# EAGLE design 209_ktemp (EAGLE 9.6.2)
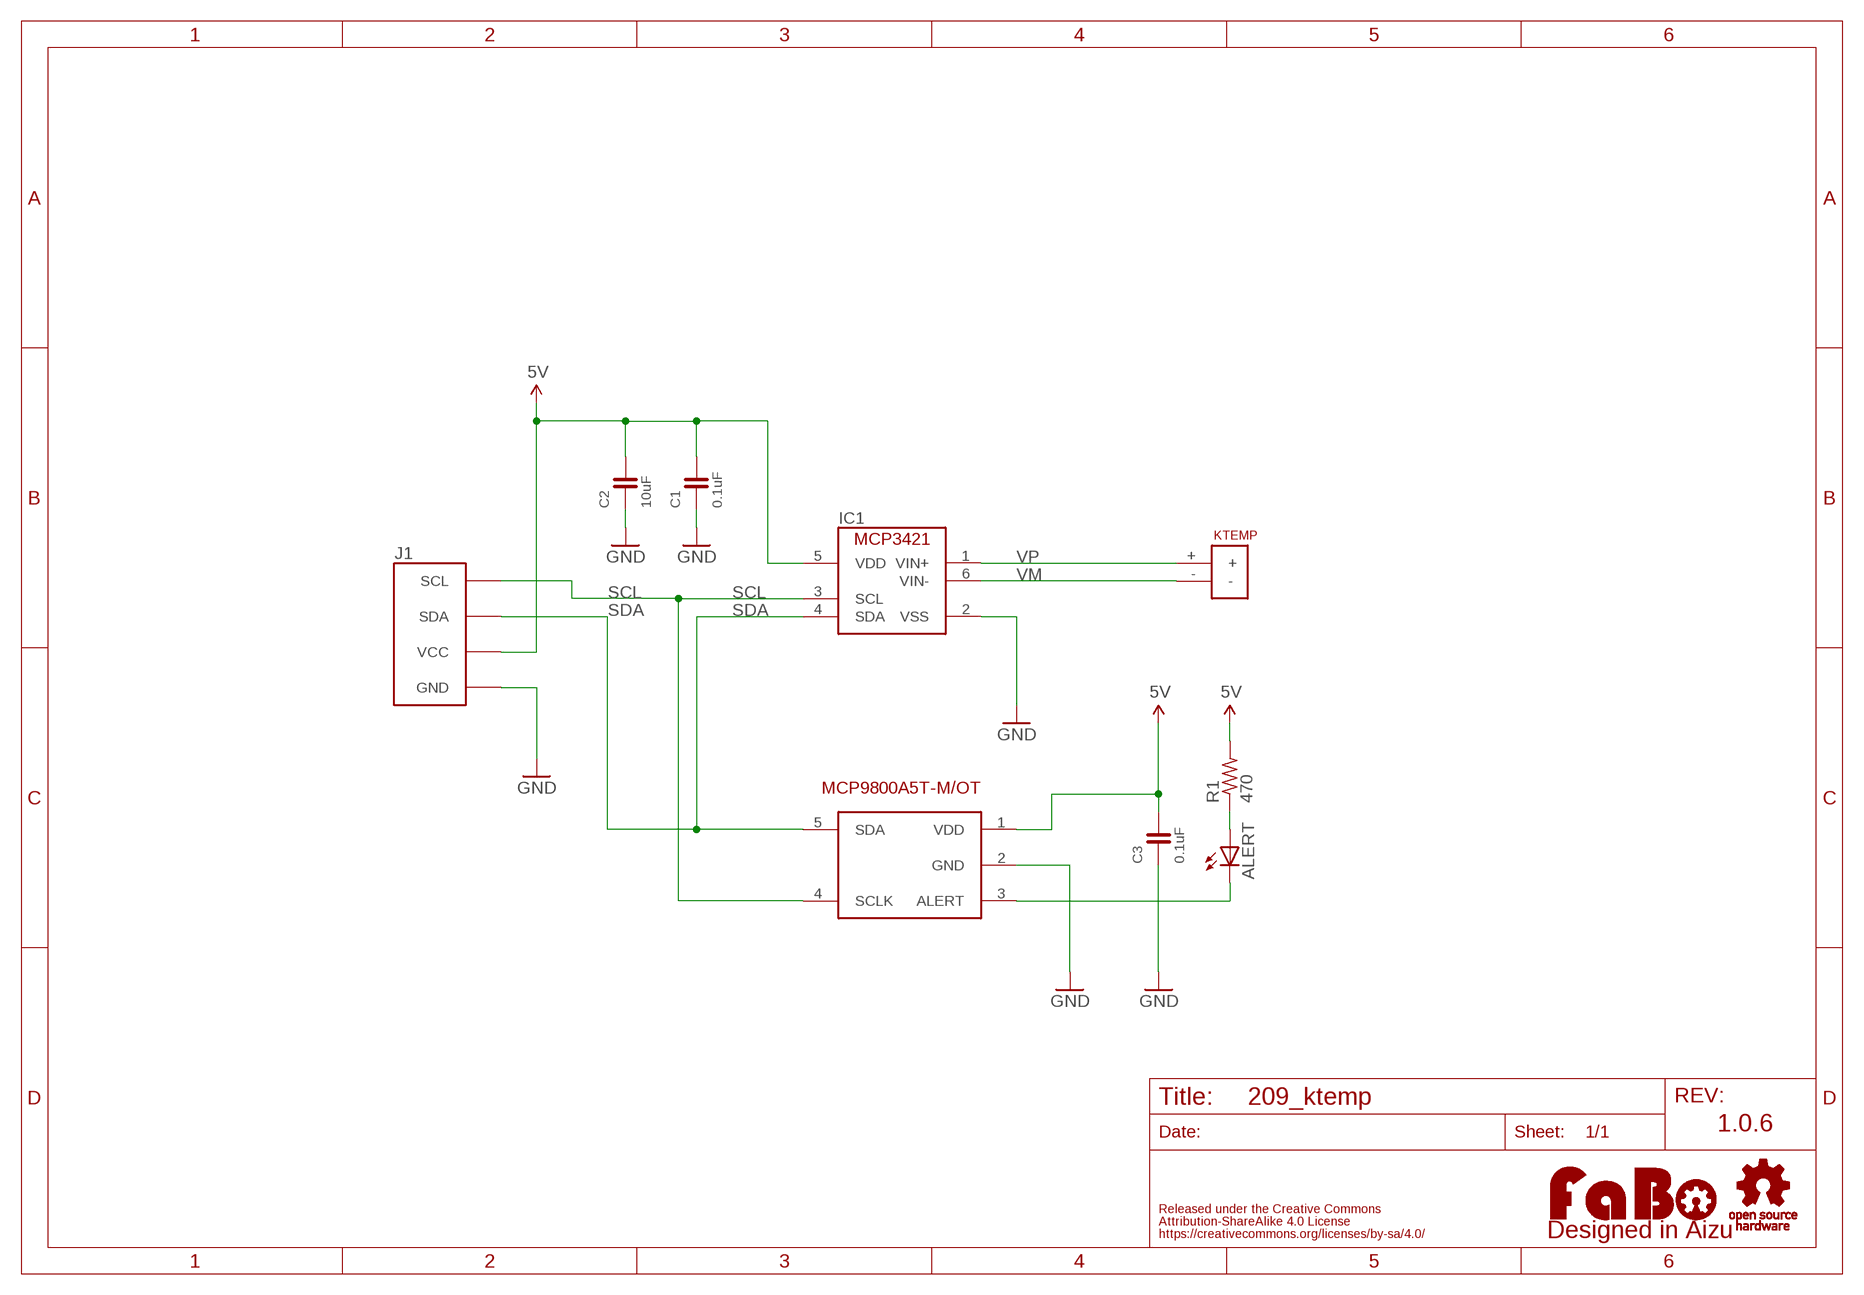
[diagram p0: schematic, sheet 1]

## Parts
ALERT  LEDCHIP-LED0603  [CHIP-LED0603]
C1  0.1uF  CAPACITOR-0603  [0603]
C2  10uF  CAPACITOR-0603  [0603]
C3  0.1uF  CAPACITOR-0603  [0603]
IC1  MCP3421  [SOT-23]
J1  FABO_BRICK_I2CI2C_TEMP_LOG2  [FABO_BRICK_I2C_LONG2]
LOGO1  LOGO_FABO-M  [LOGO_FABO_M]
R1  470  R-US_R0603  [R0603]
U$2  PCC-SMP-J  [PCC-SMP-J]
U$3  LOGO_OSHW-M_BOTTOM  [LOGO_OSHW_M_BOTTOM]
U$5  MCP9800_SOT-23  [SOT23-5]

## Nets
5V: C1.2 C2.2 C3.2 IC1.5(VDD) J1.VCC R1.2 U$5.1(VDD)
GND: C1.1 C2.1 C3.1 IC1.2(VSS) J1.GND U$5.2(GND)
N$1: ALERT.A R1.1
N$2: ALERT.C U$5.3(ALERT)
SCL: IC1.3(SCL) J1.SCL U$5.4(SCLK)
SDA: IC1.4(SDA) J1.SDA U$5.5(SDA)
VM: IC1.6(VIN-) U$2.-
VP: IC1.1(VIN+) U$2.+

## Notes on the sheet
- 1.0.6

## Library data of the parts
ALERT = led:LED: LED OSRAM: - CHIPLED LG R971, LG N971, LY N971, LG Q971, LY Q971, LO R971, LY R971 LH N974, LH R974 LS Q976, LO Q976, LY Q976 LO Q996 - Hyper CHIPLED LW Q18S LB Q993, LB Q99A, LB R99A - SideLED LS A670, LO A670, LY A670, LG A670, LP A670 LB A673, LV A673, LT A673, LW A673 LH A674 LY A675 LS A676, LA A676, LO A676, LY A676, LW A676 LS A679, LY A679, LG A679 - Hyper Micro SIDELED® LS Y876, LA Y876, LO Y876, LY Y876 LT Y87S - SmartLED LW L88C, LW L88S LB L89C, LB L89S, LG L890 LS L89K, LO L89K, LY L89K LS L896, LA L896, LO L896, LY L896 - TOPLED LS T670, LO T670, LY T670, LG T670, LP T670 LSG T670, LSP T670, LSY T670, LOP T670, LYG T670 LG T671, LOG T671, LSG T671 LB T673, LV T673, LT T673, LW T673 LH T674 LS T676, LA T676, LO T676, LY T676, LB T676, LH T676, LSB T676, LW T676 LB T67C, LV T67C, LT T67C, LS T67K, LO T67K, LY T67K, LW E67C LS E67B, LA E67B, LO E67B, LY E67B, LB E67C, LV E67C, LT E67C LW T67C LS T679, LY T679, LG T679 LS T770, LO T770, LY T770, LG T770, LP T770 LB T773, LV T773, LT T773, LW T773 LH T774 LS E675, LA E675, LY E675, LS T675 LS T776, LA T776, LO T776, LY T776, LB T776 LHGB T686 LT T68C, LB T68C - Hyper Mini TOPLED® LB M676 - Mini TOPLED Santana® LG M470 LS M47K, LO M47K, LY M47K Source: http://www.osram.convergy.de LUXEON: - LUMILED® LXK2-PW12-R00, LXK2-PW12-S00, LXK2-PW14-U00, LXK2-PW14-V00 LXK2-PM12-R00, LXK2-PM12-S00, LXK2-PM14-U00 LXK2-PE12-Q00, LXK2-PE12-R00, LXK2-PE12-S00, LXK2-PE14-T00, LXK2-PE14-U00 LXK2-PB12-K00, LXK2-PB12-L00, LXK2-PB12-M00, LXK2-PB14-N00, LXK2-PB14-P00, LXK2-PB14-Q00 LXK2-PR12-L00, LXK2-PR12-M00, LXK2-PR14-Q00, LXK2-PR14-R00 LXK2-PD12-Q00, LXK2-PD12-R00, LXK2-PD12-S00 LXK2-PH12-R00, LXK2-PH12-S00 LXK2-PL12-P00, LXK2-PL12-Q00, LXK2-PL12-R00 Source: www.luxeon.com KINGBRIGHT: KA-3528ASYC Source: www.kingbright.com
C1-C3 = FaBo-Capacitor:CAPACITOR: CAPACITOR
IC1 = FaBo-Sensor:MCP3421
J1 = FaBo-Template:FABO_BRICK_I2C: FaBo Brick I2C
LOGO1 = component:LOGO_FABO
R1 = rcl:R-US_: RESISTOR, American symbol; SPICEPREFIX: R
U$2 = FaBo-Connetor:PCC-SMP-J
U$3 = FaBo-etc:LOGO_OSHW
U$5 = Fabo2:MCP9800_SOT-23

## Board
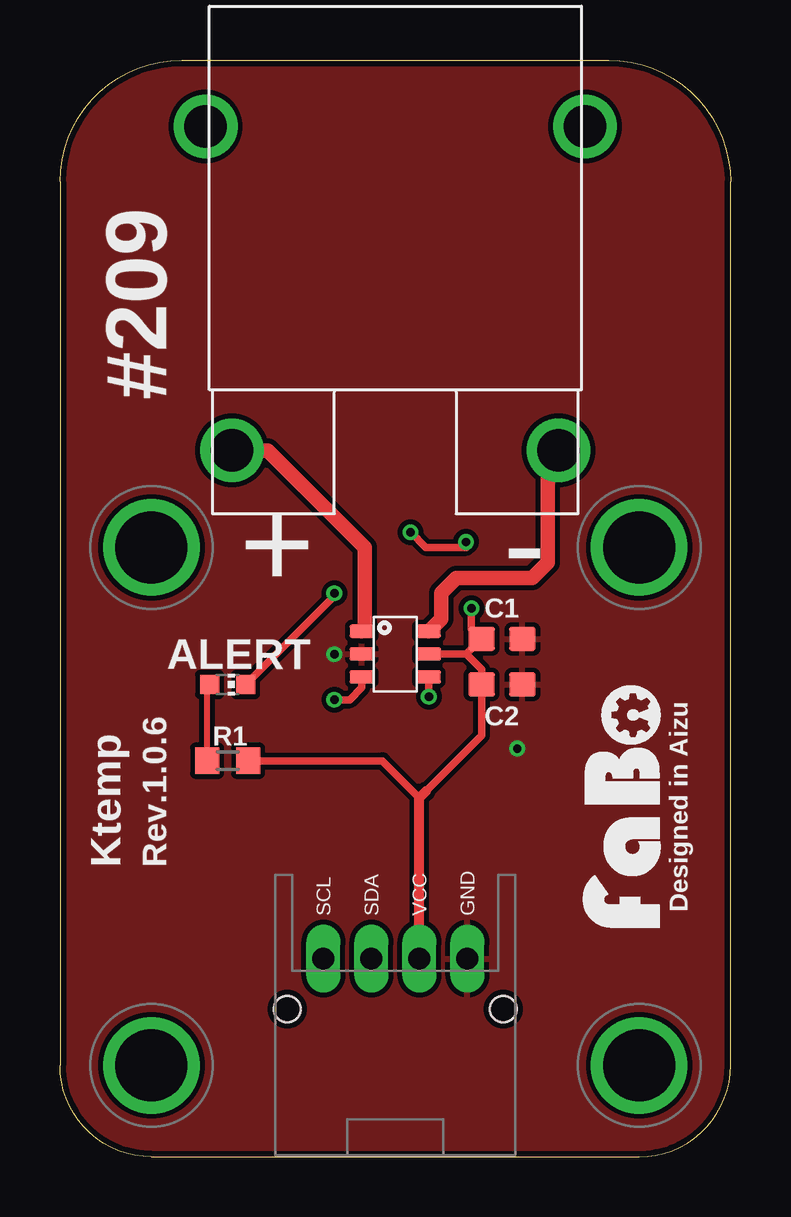
[diagram p1: board, top side]
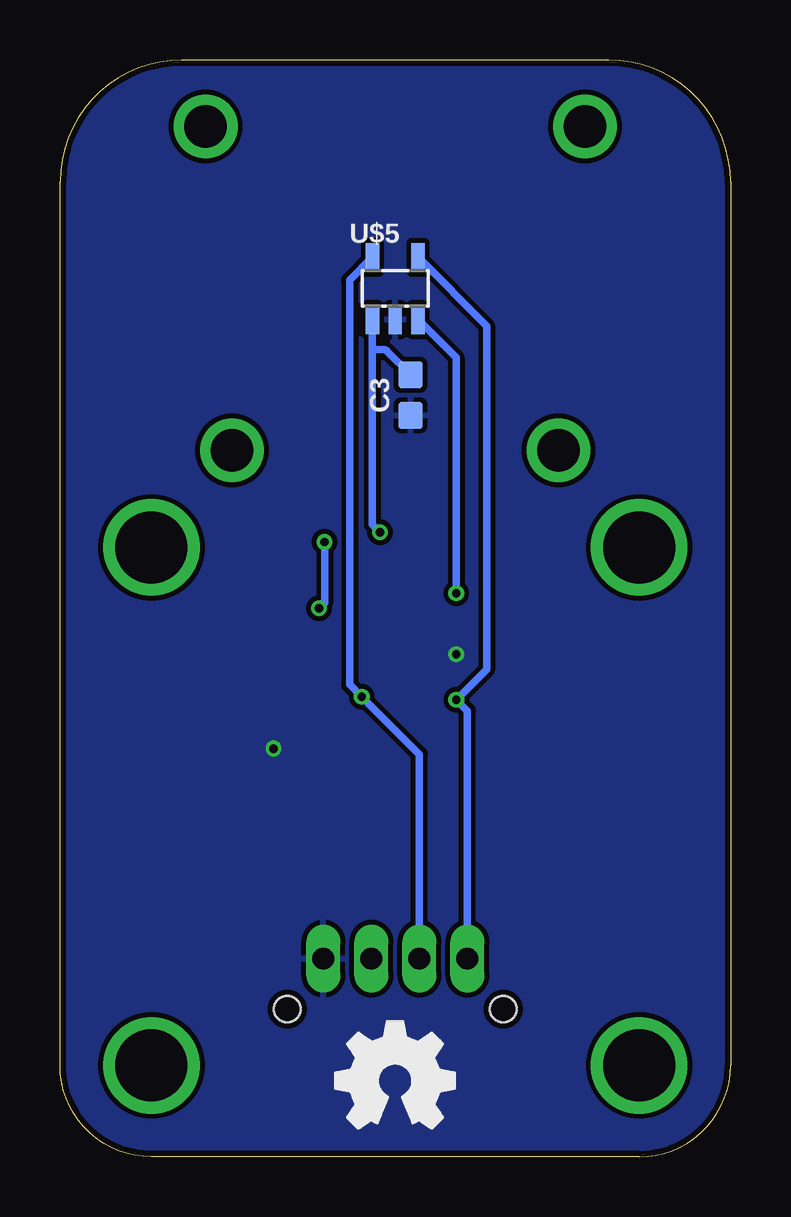
[diagram p2: board, bottom side, seen from below]

Size 27.94 x 45.72 mm. Coordinates in mm from the lower left corner, seen from the top.
Copper layers (1*16): Top 0.035mm / dielectric 1.6mm / Bottom 0.035mm
Design rules "PCBway": minimum track width 6mil, minimum drill 12mil, track to track 6mil, track to pad 6mil, pad to pad 6mil, via to via 6mil, smd to smd 6mil, copper to edge 10mil, drill to drill 10mil, minimum pad ring 10mil, minimum via ring 6mil, stop-mask expansion 2mil, vias tented up to drill 100mil, thermal gap 8mil

### Footprints (pad centres in the part's own frame; a part is rotated, then mirrored left to right if it is on the bottom)
CHIP-LED0603 = smd 0.8 x 0.8: A 0,-0.75; C 0,0.75
0603 = smd 1.1 x 1: 1 -0.85,0; 2 0.85,0
SOT-23 = smd 1 x 0.55: 1 -1.4,0.95; 2 -1.4,0; 3 -1.4,-0.95; 4 1.4,-0.95; 5 1.4,0; 6 1.4,0.95
FABO_BRICK_I2C_LONG2 = drill 0.9 pad 1.422 long: GND 3,-10.795; SCL -3,-10.795; SDA -1,-10.795; VCC 1,-10.795 | drill 3 pad 3.81: P$1 -10.16,6.35; P$2 10.16,6.35; P$3 -10.16,-15.24; P$4 10.16,-15.24 | hole 1.1: -4.5,-12.895; 4.5,-12.895
R0603 = smd 1 x 1.1: 1 -0.85,0; 2 0.85,0
PCC-SMP-J = drill 1.77: + -6.8,-6.75; - 6.8,-6.75; P$3 -7.9,6.75; P$4 7.9,6.75
SOT23-5 = smd 0.55 x 1.2: 1 -0.95,-1.3; 2 0,-1.3; 3 0.95,-1.3; 4 0.95,1.3; 5 -0.95,1.3

### Placement (x,y rotation side)
ALERT  6.99,19.68 270 top
C1  18.41,21.59 180 top
C2  18.41,19.68 180 top
C3  13.34,31.75 90 bottom
IC1  13.97,20.95 0 top
J1  13.97,19.05 0 top
LOGO1  25.4,14.61 90 top
R1  6.99,16.51 0 top
U$2  13.97,36.2 0 top
U$3  13.97,3.17 0 top
U$5  13.97,36.2 0 bottom

### Tracks (layer width: path | path; a pad name or v marks a point on that pad's centre or on a via)
5V  (via drill 0.35)
  Top 0.305: 16.93,20.95 IC1.5 | 16.93,20.95 C1.2 17.14,22.01 v17.14,22.86 | v14.61,26.04 15.24,25.4 16.94,25.4 17.04,25.5 v16.92,25.63 | R1.2 13.43,16.51 14.97,14.97 | 15.24,15.24 17.57,17.57 C2.2 17.57,20.32 16.93,20.95
  Top 0.406: J1.VCC 14.97,14.97 15.24,15.24
  Bottom 0.305: U$5.1 14.92,33.66 | 14.92,33.66 14.92,26.35 v14.61,26.04 | v16.92,25.63 16.92,23.09 v17.14,22.86 | C3.2 14.32,33.58 arc-45 14.49,33.66 14.92,33.66
GND  (via drill 0.35)
  other vias: 11.43,20.95 19.05,17.02
  pour Bottom (isolate 0.203): 0,0 27.94,0 27.94,45.72 0,45.72
  pour Top (isolate 0.203): 0,0 27.94,0 27.94,45.72 0,45.72
N$1
  Top 0.254: R1.1 6.13,19.59 ALERT.A
N$2  (via drill 0.35)
  Top 0.305: ALERT.C 11.43,23.38 v11.43,23.5
  Bottom 0.305: U$5.3 11.43,33.3 v11.43,23.5
SCL  (via drill 0.35)
  Top 0.305: v11.43,19.05 12.06,19.05 12.57,19.55 IC1.3
  Bottom 0.305: U$5.4 10.16,34.63 10.16,20.32 v11.43,19.05 10.97,18.59 J1.SCL
SDA  (via drill 0.35)
  Top 0.305: IC1.4 v15.37,19.18
  Bottom 0.305: U$5.5 15.88,36.54 15.88,19.68 v15.37,19.18 12.97,16.78 J1.SDA
VM
  Top 0.61: IC1.6 15.88,22.41 15.88,23.5 16.51,24.13 19.68,24.13 20.32,24.77 20.32,29 U$2.-
VP
  Top 0.61: IC1.1 12.7,22.04 12.7,25.4 8.65,29.45 U$2.+

### Text on the board
tPlace: #209 | Designed in Aizu | Ktemp | Rev.1.0.6